# Altium project Presgo.PrjPcb
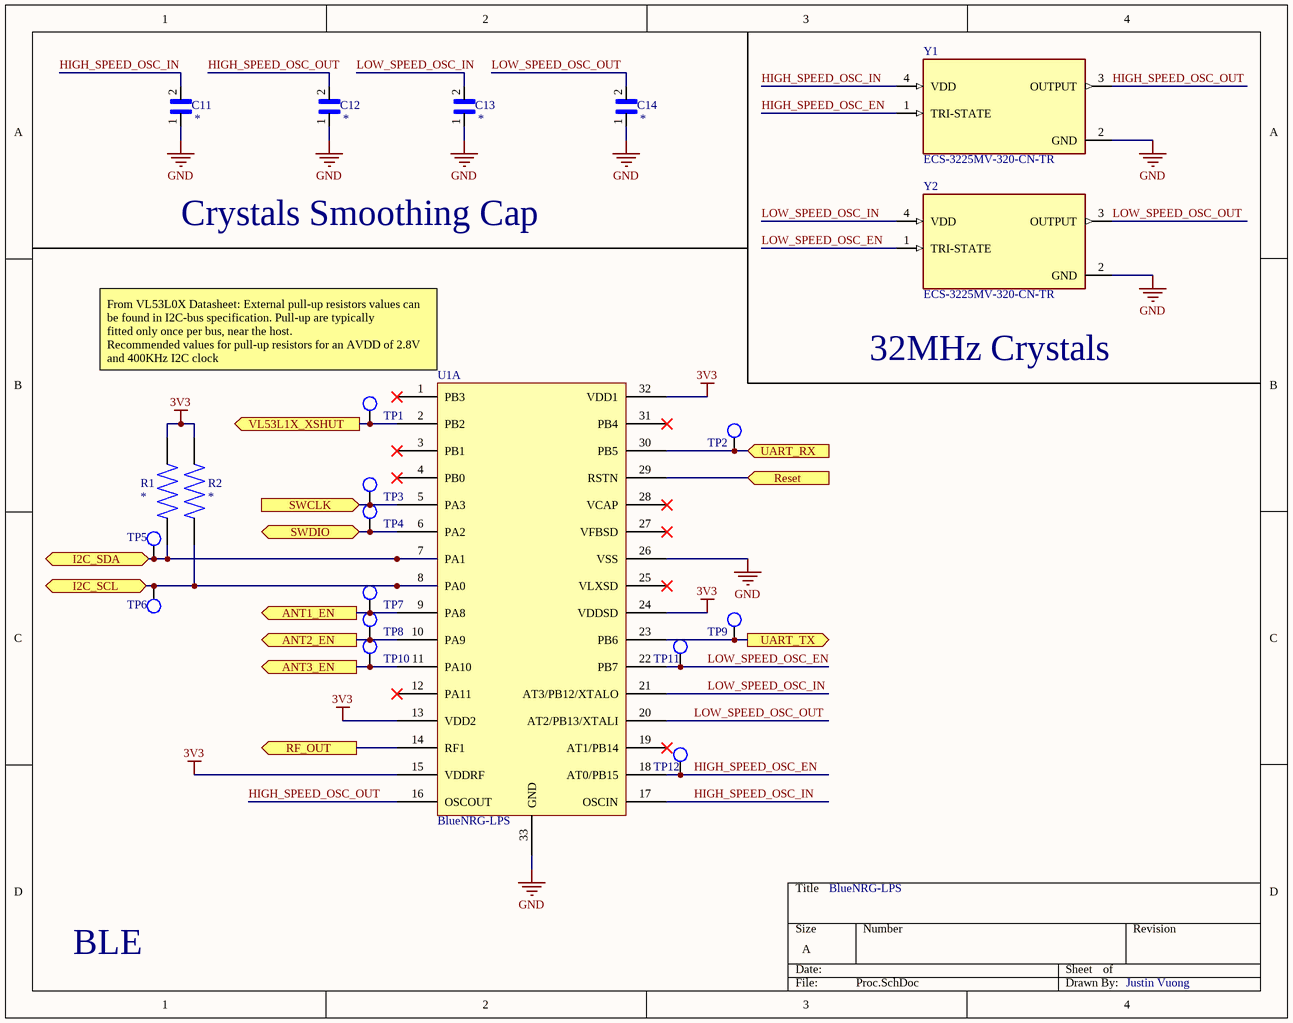
[diagram p0: Proc.SchDoc]
4 sheets, 42 parts. Net scope: flat (ports and power ports of the same name join across sheets).
Board file: Presgo.PcbDoc
Sheets:
  Proc.SchDoc
  Antenna.SchDoc
  Sensor.SchDoc
  Power.SchDoc

## Sheet Proc.SchDoc
size A; SheetNumber: 1; SheetTotal: 4

### Parts
C11  04025A8R2CAT2A  [CAPC1005X56N]  (value not drawn)
C12  04025A8R2CAT2A  [CAPC1005X56N]  (value not drawn)
C13  04025A8R2CAT2A  [CAPC1005X56N]  (value not drawn)
C14  04025A8R2CAT2A  [CAPC1005X56N]  (value not drawn)
R1  RC0402JR-072KL  [RESC1005X40N]  (value not drawn)
R2  RC0402JR-072KL  [RESC1005X40N]  (value not drawn)
TP1  TESTPOINT_LOOP  [PCBComponent_1]  (value not drawn)
TP2  TESTPOINT_LOOP  [PCBComponent_1]  (value not drawn)
TP3  TESTPOINT_LOOP  [PCBComponent_1]  (value not drawn)
TP4  TESTPOINT_LOOP  [PCBComponent_1]  (value not drawn)
TP5  TESTPOINT_LOOP  [PCBComponent_1]  (value not drawn)
TP6  TESTPOINT_LOOP  [PCBComponent_1]  (value not drawn)
TP7  TESTPOINT_LOOP  [PCBComponent_1]  (value not drawn)
TP8  TESTPOINT_LOOP  [PCBComponent_1]  (value not drawn)
TP9  TESTPOINT_LOOP  [PCBComponent_1]  (value not drawn)
TP10  TESTPOINT_LOOP  [PCBComponent_1]  (value not drawn)
TP11  TESTPOINT_LOOP  [PCBComponent_1]  (value not drawn)
TP12  TESTPOINT_LOOP  [PCBComponent_1]  (value not drawn)
U1  BlueNRG-LPS  [VFQFPN32-5x5mm-M]  (part A of 3)
Y1  ECS-3225MV-320-CN-TR  [OSC_ECS-2333-160-BN-TR]
Y2  ECS-3225MV-320-CN-TR  [OSC_ECS-2333-160-BN-TR]

### Ports
ANT1_EN (out, see Antenna[2C]), ANT2_EN (out, see Antenna[1D]), ANT3_EN (out, see Antenna[1C]), I2C_SCL (bidir, see Sensor[1B]), I2C_SDA (bidir, see Sensor[1B]), Reset (in, see Power[4A]), RF_OUT (out, see Antenna[1A]), SWCLK (in, see Power[3A]), SWDIO (bidir, see Power[3A]), UART_RX (in, see Power[4A]), UART_TX (out, see Power[4A]), VL53L1X_XSHUT (out, see Sensor[1A])

### Nets
3V3: R1.2 R2.1 U1.13(VDD2) U1.15(VDDRF) U1.24(VDDSD) U1.32(VDD1)  [project net AVDD]
GND: C11.1 C12.1 C13.1 C14.1 U1.26(VSS) U1.33(GND) Y1.2(GND) Y2.2(GND)
HIGH_SPEED_OSC_EN: TP12.1 U1.18(AT0/PB15) Y1.1(TRI-STATE)
HIGH_SPEED_OSC_IN: C11.2 U1.17(OSCIN) Y1.4(VDD)
HIGH_SPEED_OSC_OUT: C12.2 U1.16(OSCOUT) Y1.3(OUTPUT)
LOW_SPEED_OSC_EN: TP11.1 U1.22(PB7) Y2.1(TRI-STATE)
LOW_SPEED_OSC_IN: C13.2 U1.21(AT3/PB12/XTALO) Y2.4(VDD)
LOW_SPEED_OSC_OUT: C14.2 U1.20(AT2/PB13/XTALI) Y2.3(OUTPUT)
XSHUT: TP1.1 U1.2(PB2) ; port VL53L1X_XSHUT
NetC1_1: U1.14(RF1) ; port RF_OUT
NetI1_1: TP10.1 U1.11(PA10) ; port ANT3_EN
NetI1_6: TP8.1 U1.10(PA9) ; port ANT2_EN
NetI1_9: TP7.1 U1.9(PA8) ; port ANT1_EN
NetJ1_2: TP4.1 U1.6(PA2) ; port SWDIO
NetJ1_3: TP3.1 U1.5(PA3) ; port SWCLK
NetJ1_5: U1.29(RSTN) ; port Reset
NetJ1_6: TP2.1 U1.30(PB5) ; port UART_RX
NetJ1_7: TP9.1 U1.23(PB6) ; port UART_TX
NetR1_1: R1.1 TP5.1 U1.7(PA1) ; port I2C_SDA
NetR2_2: R2.2 TP6.1 U1.8(PA0) ; port I2C_SCL

Not connected (* = marked no-connect by the designer): U1 1(PB3)* 3(PB1)* 4(PB0)* 12(PA11)* 19(AT1/PB14)* 25(VLXSD)* 27(VFBSD)* 28(VCAP)* 31(PB4)*

### Notes on the sheet
- Crystals Smoothing Cap
- From VL53L0X Datasheet: External pull-up resistors values can be found in I2C-bus specification. Pull-up are typically
  fitted only once per bus, near the host.
  Recommended values for pull-up resistors for an AVDD of 2.8V and 400KHz I2C clock
  would be 1.5k to 2k Ohms.
- 32MHz Crystals
- BlueNRG-LPS
- BLE
- Justin Vuong

### Library data of the parts
C11-C14 = 04025A8R2CAT2A: 0402 8,2 pF 50 V Â± 0,25 pF TolÃ©rance C0G / NP0 Condensateur cÃ©ramique multicouche SMT; MF: AVX; Digi-Key_Purchase_URL: https://www.digikey.tn/product-detail/en/avx-corporation/04025A8R2CAT2A/478-1069-1-ND/564101?utm_source=snapeda&utm_medium=aggregator&utm_campaign=symbol; Digi-Key_Part_Number: 478-1069-1-ND; Package: 1005 AVX; Value: *; MP: 04025A8R2CAT2A; SnapEDA_Link: https://www.snapeda.com/parts/04025A8R2CAT2A/AVX/view-part/449449/?ref=snap
R1 R2 = RC0402JR-072KL: 2 kOhms Â±5% 0.063W, 1/16W Chip Resistor 0402 (1005 Metric) Moisture Resistant Thick Film; MF: Yageo; DigiKey_Part_Number: 311-2.0KJRTR-ND; Purchase-URL: https://pricing.snapeda.com/search?q=RC0402JR-072KL&ref=eda; Package: 1005 Panasonic Electronic Components; Check_prices: https://www.snapeda.com/parts/RC0402JR-072KL/Yageo/view-part/?ref=eda; Value: *; SnapEDA_Link: https://www.snapeda.com/parts/RC0402JR-072KL/Yageo/view-part/?ref=snap; MP: RC0402JR-072KL
TP1-TP12 = TESTPOINT_LOOP: PC TEST POINT MINIATURE WHITE; Manufacturer 1: Keystone Electronics; Manufacturer Part Number 1: 5002; Supplier Part Number 1: 36-5002-ND; Supplier 1: Digi-Key; Mount: Through Hole
U1 = BlueNRG-LPS: IC RF TxRx + MCU Bluetooth Bluetooth v5.3 2.4GHz 32-VFQFN Exposed Pad; Supplier 1: Mouser; Supplier Part Number 1: 511-BLUENRG-332AT
Y1 Y2 = ECS-3225MV-320-CN-TR: subminiature SMD oscillators.; Package: None; Price: None; Value: *; MP: ECS-3225MV-320-CN-TR; Availability: Unavailable

## Sheet Antenna.SchDoc
size A; SheetNumber: 2; SheetTotal: 4
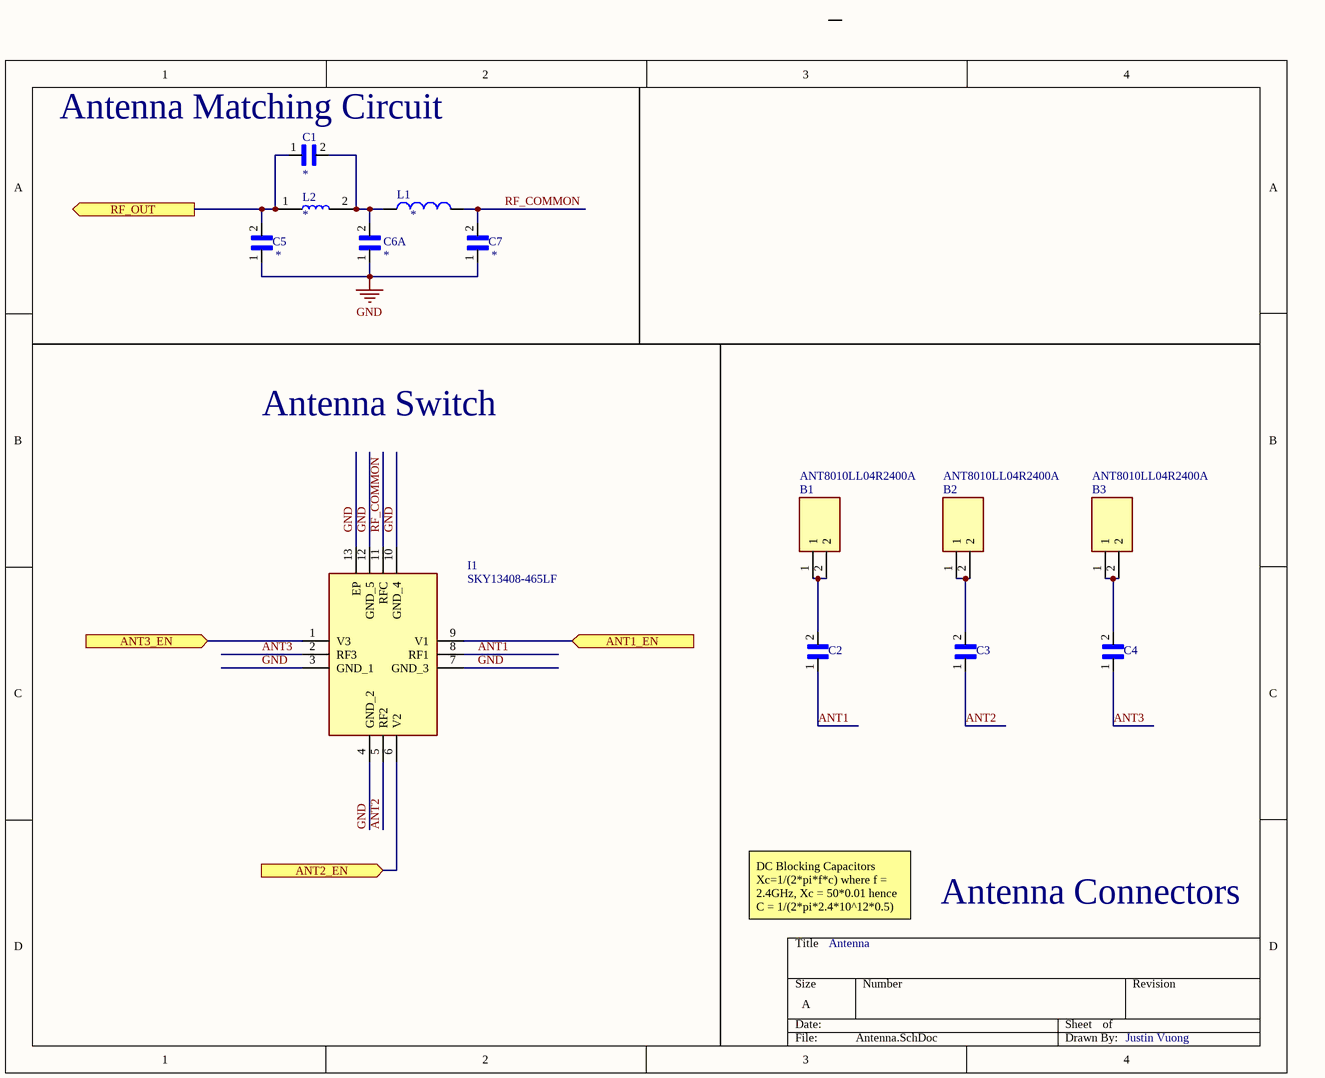
[diagram p1: Antenna.SchDoc]

### Parts
B1  ANT8010LL04R2400A  [ANT8010LL04R2400A]
B2  ANT8010LL04R2400A  [ANT8010LL04R2400A]
B3  ANT8010LL04R2400A  [ANT8010LL04R2400A]
C1  GRM0335C1HR40BA01D  [INDC0603X33N]  (value not drawn)
C2  GCM1555C1HR80BA16D  [CAPC1005X55N]  (value not drawn)
C3  GCM1555C1HR80BA16D  [CAPC1005X55N]  (value not drawn)
C4  GCM1555C1HR80BA16D  [CAPC1005X55N]  (value not drawn)
C5  GCM1555C1HR80BA16D  [CAPC1005X55N]  (value not drawn)
C6  GRM0335C1H1R6BA01D  [CAPC0603X33N]  (value not drawn)  (part A of 2)
C7  GRM0335C1HR60BA01D  [CAPC0603X33N]  (value not drawn)
I1  SKY13408-465LF  [QFN50P200X200X65-13N-D]
L1  LQP03TN3N0B02D  [INDC0603X33N]  (value not drawn)
L2  L-07C2N4SV6T  [INDC1005X60N]  (value not drawn)

### Ports
ANT1_EN (in, see Proc[1C]), ANT2_EN (in, see Proc[1C]), ANT3_EN (in, see Proc[1C]), RF_OUT (out, see Proc[1C])

### Nets
GND: C5.1 C6.1 C7.1 I1.3(GND_1) I1.4(GND_2) I1.7(GND_3) I1.10(GND_4) I1.12(GND_5) I1.13(EP)
ANT1: C2.1 I1.8(RF1)
ANT2: C3.1 I1.5(RF2)
ANT3: C4.1 I1.2(RF3)
RF_COMMON: C7.2 I1.11(RFC) L1.2
NetB1_1: B1.1 B1.2 C2.2
NetB2_1: B2.1 B2.2 C3.2
NetB3_1: B3.1 B3.2 C4.2
NetC1_1: C1.1 C5.2 L2.1 ; port RF_OUT
NetC1_2: C1.2 C6.2 L1.1 L2.2
NetI1_1: I1.1(V3) ; port ANT3_EN
NetI1_6: I1.6(V2) ; port ANT2_EN
NetI1_9: I1.9(V1) ; port ANT1_EN

### Notes on the sheet
- (near C1) Antenna Matching Circuit
- Antenna Switch
- DC Blocking Capacitors                   Xc=1/(2*pi*f*c) where f = 2.4GHz, Xc = 50*0.01 hence                                  C = 1/(2*pi*2.4*10^12*0.5)    C = 132pF
- Antenna
- Antenna Connectors
- Justin Vuong

### Library data of the parts
B1-B3 = ANT8010LL04R2400A: Antennas 2.4GHz 50 Ohm 1W CHIP ANTENNA; Manufacturer_Name: Pulse Electronics; Geometry.Height: 1.1mm; Mouser Part Number: 603-ANT8010LL04R2400; Mouser Price/Stock: https://www.mouser.co.uk/ProductDetail/PulseLarsen-Antennas/ANT8010LL04R2400A?qs=CqAAFKzD4h85SLrouu%252B8rQ%3D%3D; Manufacturer_Part_Number: ANT8010LL04R2400A; Datasheet Link: *
C1 = GRM0335C1HR40BA01D: 0201 50 V 0.4 pF Â±0.1 pF Tolerance C0G Monolithic Ceramic Chip Capacitor; Package: None; Price: None; Value: *; MP: GRM0335C1HR40BA01D; Availability: Unavailable
C2-C5 = GCM1555C1HR80BA16D: SMD Capacitor C0G(EIA) with Capacitance: 0.80pF Tol. 0.1pF. Rated Voltage: 50Vdc; Package: None; Price: None; Value: *; MP: GCM1555C1HR80BA16D; Availability: Unavailable
C6 = GRM0335C1H1R6BA01D: SMD capacitor C0G(EIA) with capacitance 1.6pF Tol.0.1pF. Rated voltage 50Vdc 125C; MF: Murata; Price: None; SnapEDA_Link: https://www.snapeda.com/parts/GRM0335C1H1R6BA01D/Murata/view-part/1800095/?ref=snap; Purchase-URL: https://pricing.snapeda.com/search/part/GRM0335C1H1R6BA01D/?ref=eda; Check_prices: https://www.snapeda.com/parts/GRM0335C1H1R6BA01D/Murata/view-part/1800095/?ref=eda; Value: *; MP: GRM0335C1H1R6BA01D; Package: 0603 Taiyo Yuden; Availability: Warning
C7 = GRM0335C1HR60BA01D: Cap Ceramic 0.6pF 50V C0G 0.1pF Pad SMD 0201 125C T/R; Package: None; Price: None; Value: *; MP: GRM0335C1HR60BA01D; Availability: Unavailable
I1 = SKY13408-465LF: RF Switch ICs 1-6GHz SP3T Typ. IIP3 54dBm; Manufacturer_Name: Skyworks; Geometry.Height: 0.65mm; Mouser Part Number: 873-SKY13408-465LF; Mouser Price/Stock: https://www.mouser.co.uk/ProductDetail/Skyworks-Solutions-Inc/SKY13408-465LF?qs=vH2uEH3KBjVVWQxF8QP0rg%3D%3D; Manufacturer_Part_Number: SKY13408-465LF; Datasheet Link: https://datasheet.datasheetarchive.com/originals/distributors/DKDS-19/379019.pdf
L1 = LQP03TN3N0B02D: Inductor with Inductance: 3nH Tol. +/-0.1nH, Package: 0201 (0603); MF: Murata; Check_prices: https://www.snapeda.com/parts/LQP03TN3N0B02D/Murata%20Electronics%20North%20America/view-part/1501789/?ref=eda; Package: 0603 Murata; Digi-Key_Part_Number: 490-6727-1-ND; Value: *; MP: LQP03TN3N0B02D; SnapEDA_Link: https://www.snapeda.com/parts/LQP03TN3N0B02D/Murata%20Electronics%20North%20America/view-part/1501789/?ref=snap; Purchase-URL: https://pricing.snapeda.com/search/part/LQP03TN3N0B02D/?ref=eda
L2 = L-07C2N4SV6T: INDUCTOR RF, 0402, 2.4NH, Â±0.3NH; Inductance:2.4nH; Inductance Tolerance:Â± 0.3nH; Self Resonant Frequency:10GHz; DC Current Rating:300mA; Q Factor:8; Q Test Frequency:100MHz; Inductor Case Style:0402; No. of Pins:2; Core Material:Ceramic; Q @ Vr F:8; Package: None; Price: None; Value: *; MP: L-07C2N4SV6T; Availability: Unavailable

## Sheet Sensor.SchDoc
size A; SheetNumber: 3; SheetTotal: 4
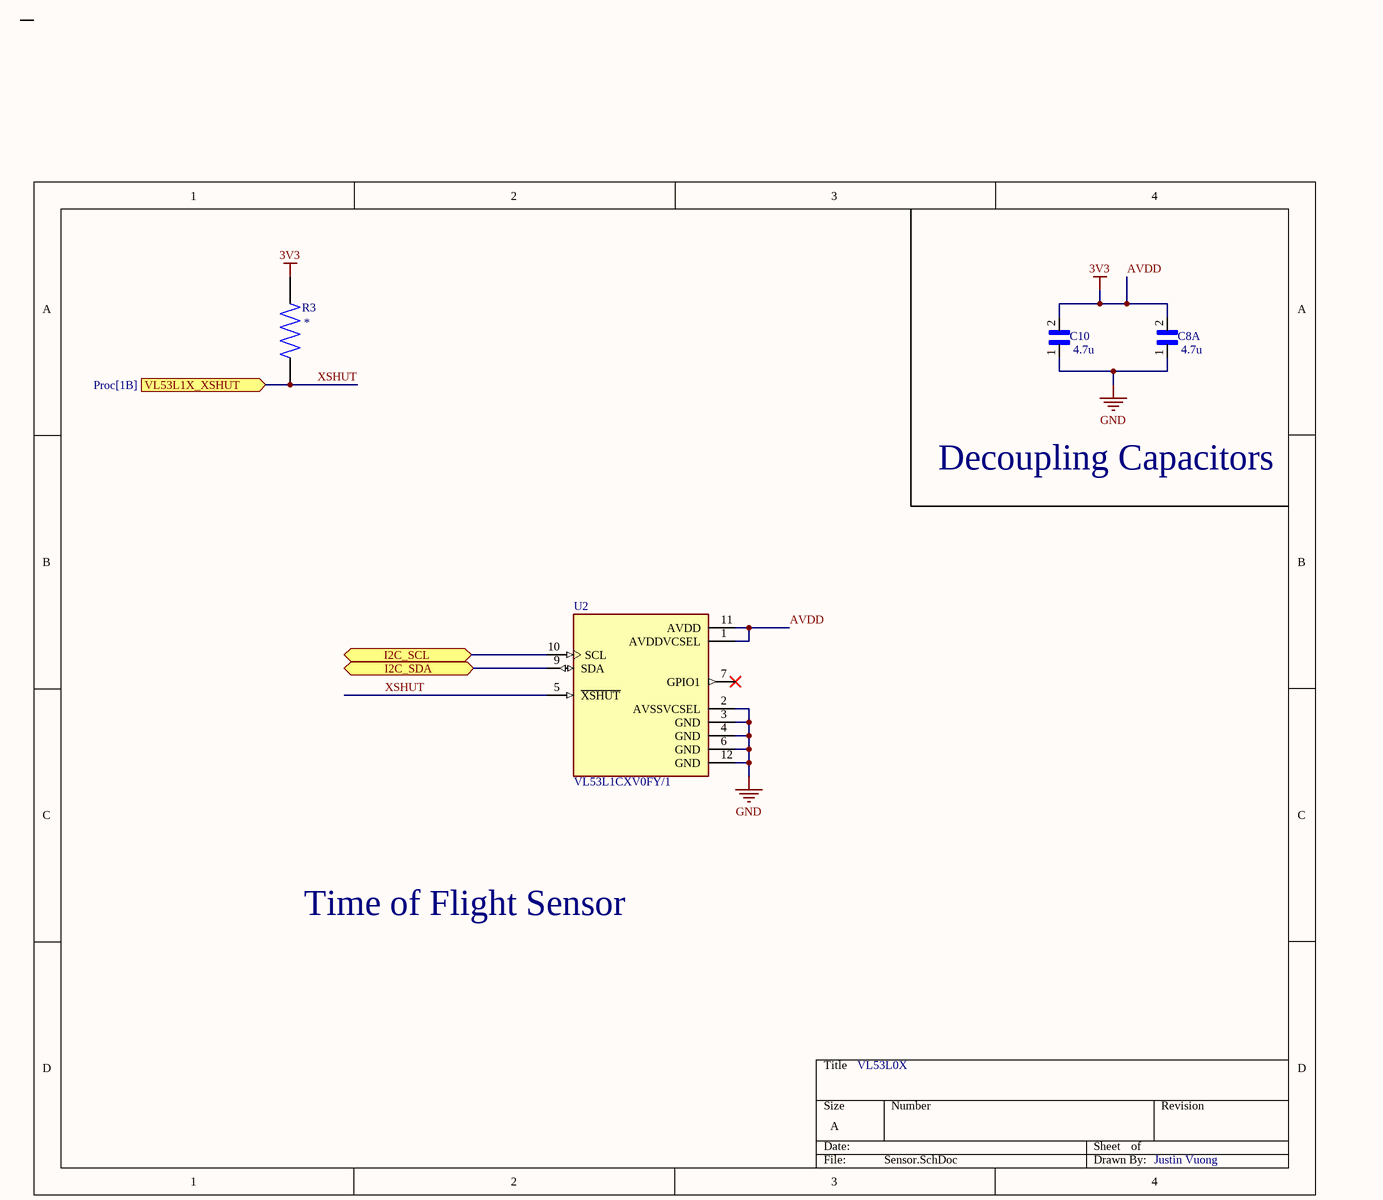
[diagram p2: Sensor.SchDoc]

### Parts
C8  value 4.7u  [CAPC0603X33N]  (hidden comment: CL10A475KQ8NNNC)  (part A of 2)
C10  value 4.7u  [CAPC1005X56N]  (hidden comment: CL05B104KA5NNNC)
R3  AC0402FR-0710KL  [RESC1005X37N]  (value not drawn)
U2  VL53L1CXV0FY/1  [SENSOR_VL53L1CXV0FY/1]

### Ports
I2C_SCL (bidir, see Proc[1C]), I2C_SDA (bidir, see Proc[1C]), VL53L1X_XSHUT (in, see Proc[1B])

### Nets
AVDD: C8.2 C10.2 R3.2 U2.1(AVDDVCSEL) U2.11(AVDD)  [also labelled 3V3]
GND: C8.1 C10.1 U2.2(AVSSVCSEL) U2.3(GND) U2.4(GND) U2.6(GND) U2.12(GND)
XSHUT: R3.1 U2.5(~{XSHUT}) ; port VL53L1X_XSHUT
NetR1_1: U2.9(SDA) ; port I2C_SDA
NetR2_2: U2.10(SCL) ; port I2C_SCL

Not connected (* = marked no-connect by the designer): U2 7(GPIO1)*

### Notes on the sheet
- Decoupling Capacitors
- Time of Flight Sensor
- VL53L0X
- Justin Vuong

### Library data of the parts
C8 = GRM0335C1H1R6BA01D: 4.7 µF ±10% 6.3V Ceramic Capacitor X5R 0603 (1608 Metric); MF: Murata; Price: None; SnapEDA_Link: https://www.snapeda.com/parts/GRM0335C1H1R6BA01D/Murata/view-part/1800095/?ref=snap; Purchase-URL: https://pricing.snapeda.com/search/part/GRM0335C1H1R6BA01D/?ref=eda; Check_prices: https://www.snapeda.com/parts/GRM0335C1H1R6BA01D/Murata/view-part/1800095/?ref=eda; MP: GRM0335C1H1R6BA01D; Package: 0603 Taiyo Yuden; Availability: Warning
C10 = 04025A8R2CAT2A: 4.7 µF ±10% 6.3V Ceramic Capacitor X5R 0603 (1608 Metric); MF: AVX; Digi-Key_Purchase_URL: https://www.digikey.tn/product-detail/en/avx-corporation/04025A8R2CAT2A/478-1069-1-ND/564101?utm_source=snapeda&utm_medium=aggregator&utm_campaign=symbol; Digi-Key_Part_Number: 478-1069-1-ND; Package: 1005 AVX; MP: 04025A8R2CAT2A; SnapEDA_Link: https://www.snapeda.com/parts/04025A8R2CAT2A/AVX/view-part/449449/?ref=snap
R3 = AC0402FR-0710KL: 10 kOhms Â±1% 0.063W, 1/16W Chip Resistor 0402 (1005 Metric) Automotive AEC-Q200, Moisture Resistant Thick Film; MF: Yageo; MP: AC0402FR-0710KL; Package: 1005 Yageo; Purchase-URL: https://pricing.snapeda.com/search/part/AC0402FR-0710KL/?ref=eda; Check_prices: https://www.snapeda.com/parts/AC0402FR-0710KL/Yageo/view-part/?ref=eda; Value: *; Digi-Key_Part_Number: YAG3436TR-ND; SnapEDA_Link: https://www.snapeda.com/parts/AC0402FR-0710KL/Yageo/view-part/?ref=snap
U2 = VL53L1CXV0FY/1: Optical Sensor 157.480 (4m) IÂ²C Output; MF: STMicroelectronics; SnapEDA_Link: https://www.snapeda.com/parts/VL53L1CXV0FY/1/STMicroelectronics/view-part/?ref=snap; Package: LGA-12 STMicroelectronics; MP: VL53L1CXV0FY/1; Check_prices: https://www.snapeda.com/parts/VL53L1CXV0FY/1/STMicroelectronics/view-part/?ref=eda; Purchase-URL: https://pricing.snapeda.com/search/part/VL53L1CXV0FY/1/?ref=eda; Price: None; Value: *; Availability: In Stock

## Sheet Power.SchDoc
size A; SheetNumber: 4; SheetTotal: 4
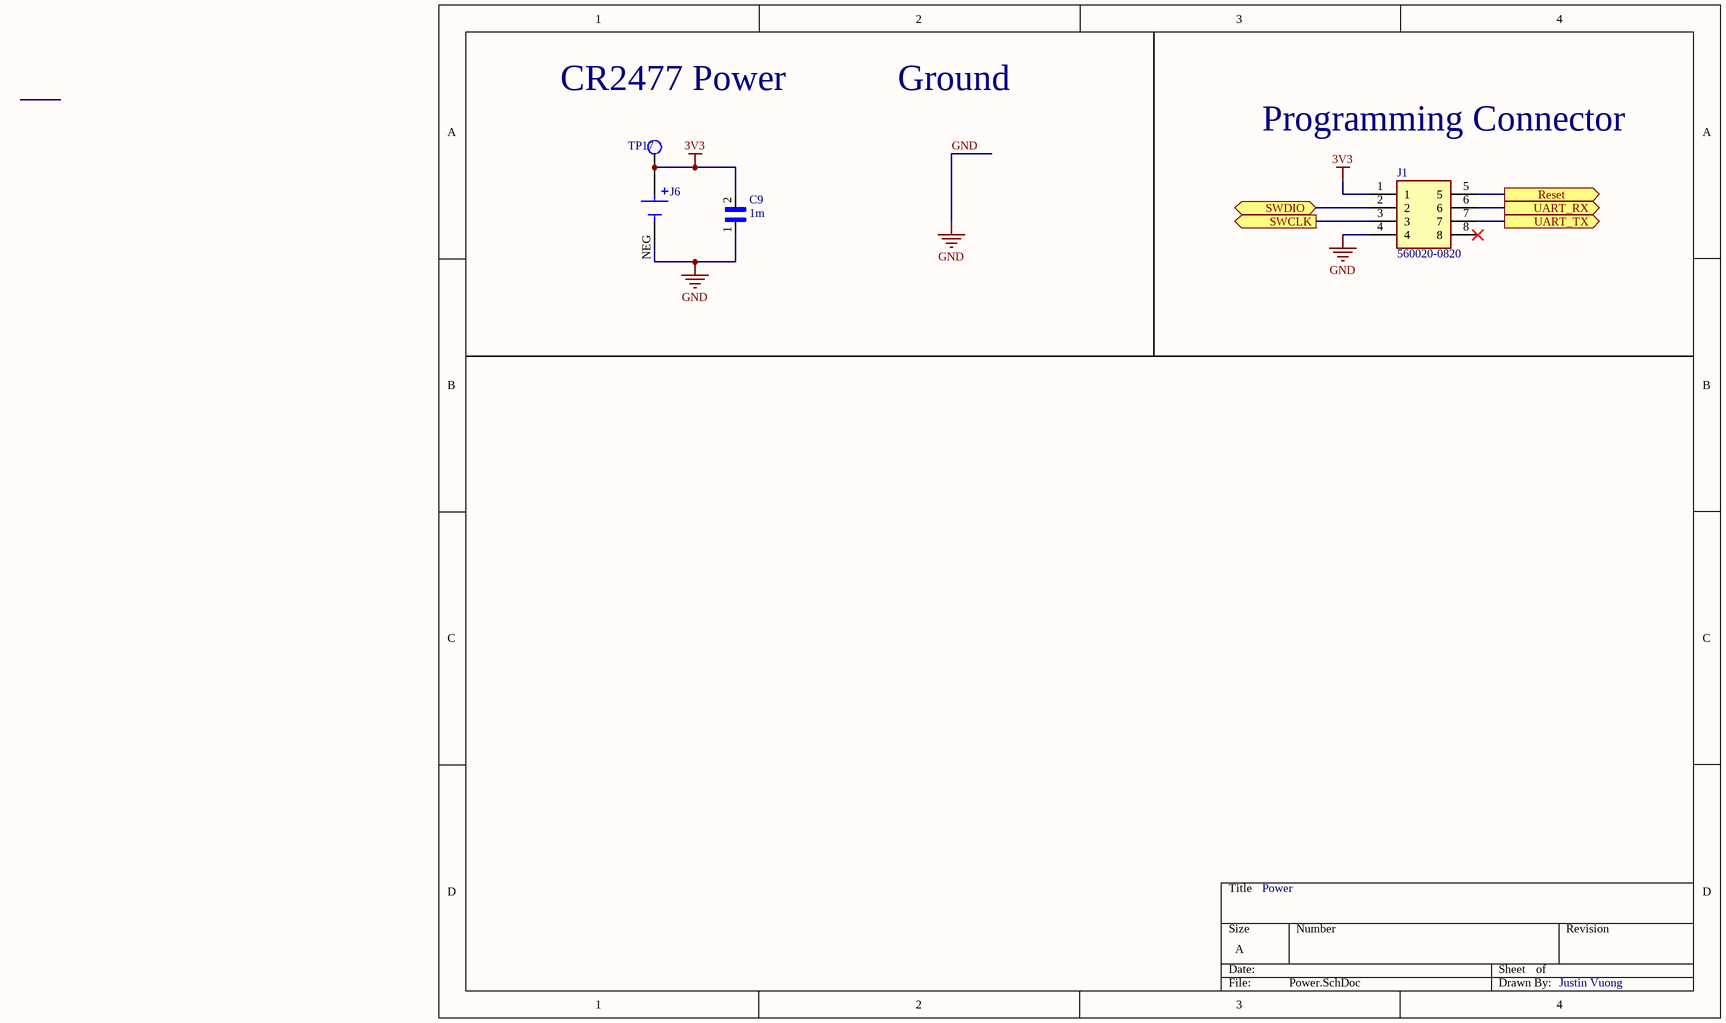
[diagram p3: Power.SchDoc]

### Parts
C9  GRM21BR60E107ME15K  [CAPC2012X145N]  (value not drawn)
J1  560020-0820  [560020-0820]
J6  BRX1-2477-SM  [BAT_BRX1-2477-SM]  (value not drawn)
TP17  TESTPOINT_LOOP  [PCBComponent_1]  (value not drawn)

### Ports
Reset (out, see Proc[3B]), SWCLK (out, see Proc[1B]), SWDIO (bidir, see Proc[1C]), UART_RX (out, see Proc[3B]), UART_TX (out, see Proc[3C])

### Nets
3V3: C9.2 J1.1 J6.1+(POS) J6.2+(POS) TP17.1  [project net AVDD]
GND: C9.1 J1.4 J6.NEG
NetJ1_2: J1.2 ; port SWDIO
NetJ1_3: J1.3 ; port SWCLK
NetJ1_5: J1.5 ; port Reset
NetJ1_6: J1.6 ; port UART_RX
NetJ1_7: J1.7 ; port UART_TX

Not connected (* = marked no-connect by the designer): J1 8*

### Notes on the sheet
- CR2477 Power
- Ground
- Programming Connector
- Power
- Justin Vuong
- (in symbol GRM21BR60E107ME15K) 1m

### Library data of the parts
C9 = GRM21BR60E107ME15K: SMD Capacitor X5R(EIA) with Capacitance: 100uF Tol. 20%. Rated Voltage: 2.5Vdc; Package: None; Price: None; Value: *; MP: GRM21BR60E107ME15K; Availability: Unavailable
J1 = 560020-0820: Connector; Manufacturer_Name: Molex; Datasheet Link: http://www.molex.com/webdocs/datasheets/pdf/en-us//5600200820_PCB_HEADERS.pdf; Manufacturer_Part_Number: 560020-0820; Mouser Part Number: 538-560020-0820; Mouser Price/Stock: https://www.mouser.co.uk/ProductDetail/Molex/560020-0820?qs=4r2B00tbnb1RvRiPBSc%252Bgw%3D%3D
J6 = BRX1-2477-SM: COIN CELL RETAINER 2477 SMT; MF: MPD; Price: None; Package: Non-Standard MPD; Value: *; MP: BRX1-2477-SM; DigiKey-Purchase-URL: https://snapeda.com/shop?store=DigiKey&id=1761043; SnapEDA_Link: https://www.snapeda.com/parts/BRX1-2477-SM/MPD%20(Memory%20Protection%20Devices)/view-part/1761043/?ref=snap; Availability: Warning
TP17 = TESTPOINT_LOOP: as TP1 on sheet Proc; Supplier Part Number 1: 36-5002-ND; Supplier 1: Digi-Key; Mount: Through Hole

## Nets that join several sheets
AVDD: Proc (6 pins), Sensor (5 pins), Power (5 pins)
GND: Proc (8 pins), Antenna (9 pins), Sensor (7 pins), Power (C9.1 J1.4 J6.NEG)
NetC1_1: Proc (U1.14), Antenna (C1.1 C5.2 L2.1)
NetI1_1: Proc (TP10.1 U1.11), Antenna (I1.1)
NetI1_6: Proc (TP8.1 U1.10), Antenna (I1.6)
NetI1_9: Proc (TP7.1 U1.9), Antenna (I1.9)
NetJ1_2: Proc (TP4.1 U1.6), Power (J1.2)
NetJ1_3: Proc (TP3.1 U1.5), Power (J1.3)
NetJ1_5: Proc (U1.29), Power (J1.5)
NetJ1_6: Proc (TP2.1 U1.30), Power (J1.6)
NetJ1_7: Proc (TP9.1 U1.23), Power (J1.7)
NetR1_1: Proc (R1.1 TP5.1 U1.7), Sensor (U2.9)
NetR2_2: Proc (R2.2 TP6.1 U1.8), Sensor (U2.10)
XSHUT: Proc (TP1.1 U1.2), Sensor (R3.1 U2.5)